# Altium schematic sheet Keyfinder.SchDoc: Keyfinder
size A4; DrawnBy: M. Schwegler; Organization: HSLU T&A; Address1: Abteilung Elektrotechnik; Address2: Technikumsstrasse 21; Address3: CH-6048 Horw; Revision: v1; SheetNumber: 2; SheetTotal: 2; Projektname: SmartBoard; DocumentName: Keyfinder; ProjectName: SmartBoard
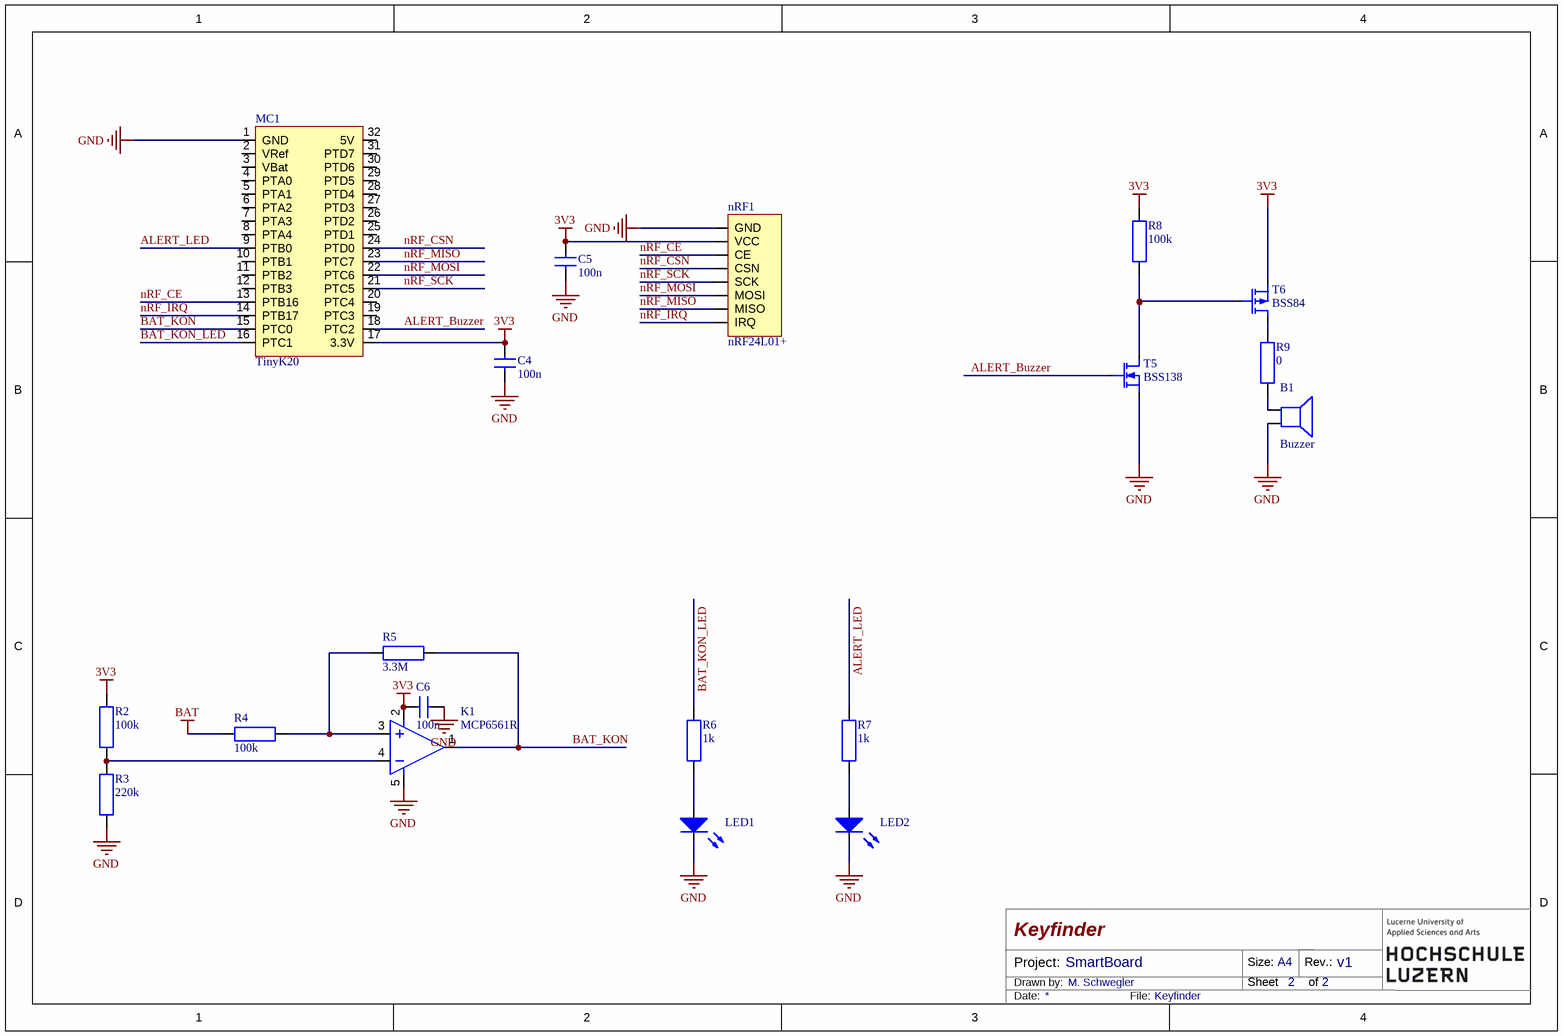
[diagram p0: Keyfinder.SchDoc]

## Parts
B1  Buzzer  [SIP2]
C4  100n  [0805_C]
C5  100n  [0805_C]
C6  100n  [0805_C]
K1  MCP6561R  [SOT23-5]
LED1  (no value)  [0805_LED]
LED2  (no value)  [0805_LED]
MC1  TinyK20  [DIP32]
nRF1  nRF24L01+  [CON_THT_2x4P_RM2.54_Stiftl]
R2  100k  [0805_R]
R3  220k  [0805_R]
R4  100k  [0805_R]
R5  3.3M  [0805_R]
R6  1k  [0805_R]
R7  1k  [0805_R]
R8  100k  [0805_R]
R9  0  [0805_R]
T5  BSS138  [SOT23-3]
T6  BSS84  [SOT23-3]

## Nets
3V3: C4.2 C5.2 C6.2 K1.2 MC1.17(3.3V) nRF1.2(VCC) R2.1 R8.1 T6.3(S)
BAT: R4.2
GND: B1.2 C4.1 C5.1 C6.1 K1.5 LED1.2(K) LED2.2(K) MC1.1(GND) nRF1.1(GND) R3.2 T5.2(S)
ALERT_Buzzer: MC1.18(PTC2) T5.1(G)
ALERT_LED: MC1.9(PTB0) R7.1
BAT_KON: K1.1 MC1.15(PTC0) R5.1
BAT_KON_LED: MC1.16(PTC1) R6.1
nRF_CE: MC1.13(PTB16) nRF1.3(CE)
nRF_CSN: MC1.24(PTD0) nRF1.4(CSN)
nRF_IRQ: MC1.14(PTB17) nRF1.8(IRQ)
nRF_MISO: MC1.23(PTC7) nRF1.7(MISO)
nRF_MOSI: MC1.22(PTC6) nRF1.6(MOSI)
nRF_SCK: MC1.21(PTC5) nRF1.5(SCK)
NetB1_1: B1.1 R9.2
NetK1_3: K1.3 R4.1 R5.2
NetK1_4: K1.4 R2.2 R3.1
NetLED1_1: LED1.1(A) R6.2
NetLED2_1: LED2.1(A) R7.2
NetR8_2: R8.2 T5.3(D) T6.2(G)
NetR9_1: R9.1 T6.1(D)

Not connected (* = marked no-connect by the designer): MC1 2(VRef) 3(VBat) 4(PTA0) 5(PTA1) 6(PTA2) 7(PTA3) 8(PTA4) 10(PTB1) 11(PTB2) 12(PTB3) 19(PTC3) 20(PTC4) 25(PTD1) 26(PTD2) 27(PTD3) 28(PTD4) 29(PTD5) 30(PTD6) 31(PTD7) 32(5V)

## Notes on the sheet
- Project:
- Drawn by:
- Size:
- Sheet
- A4
- Rev.:
- of
- Date:
- File:

## Library data of the parts
B1 = SPEAKER
C4-C6 = C?: Normaler Kondensator
K1 = OPAMP
LED1 LED2 = LED
nRF1 = Bluefruit
R2-R9 = R?: Normaler Widerstand
T5 = MOSFET-N 1D,2G,3S: Remark: *
T6 = MOSFET-P 1D,2G,3S